# Altium project Flyback.PrjPcb
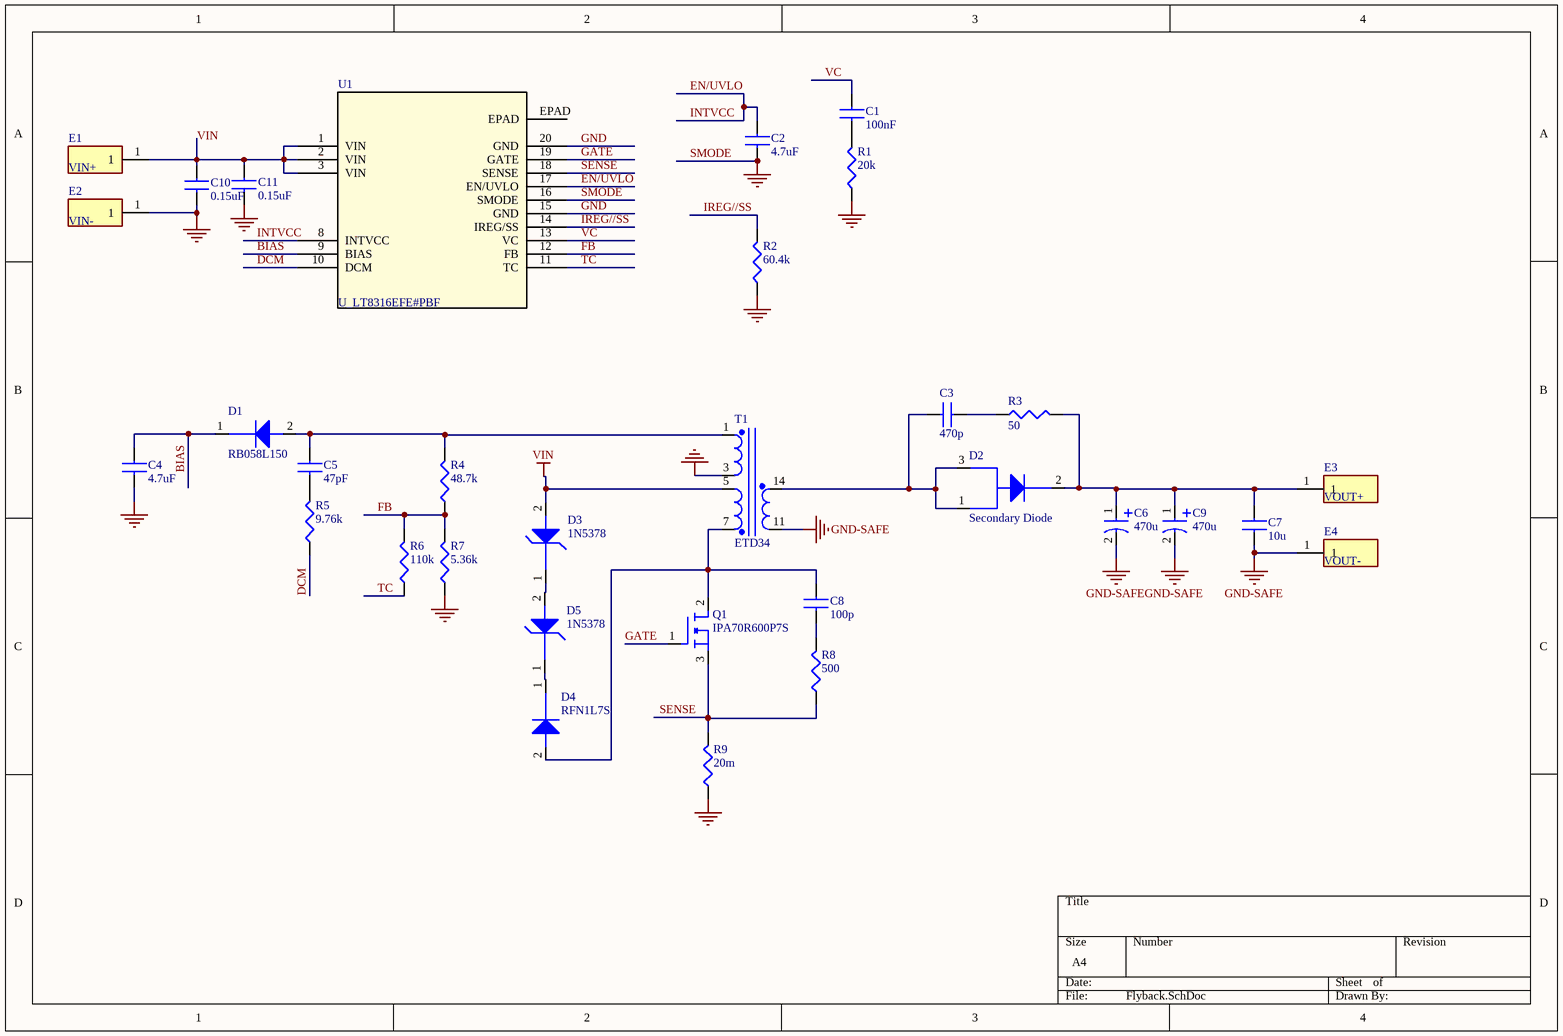
[diagram p0: Flyback.SchDoc]
1 sheet, 32 parts. Net scope: global (net labels, ports and power ports of the same name join across sheets).
Board file: Flyback.PcbDoc

## Sheet Flyback.SchDoc
size A4

### Parts
C1  100nF  [C0402]
C2  4.7uF  [C0805]
C3  470p  [C0402]
C4  4.7uF  [C0805]
C5  47pF  [C0603]
C6  470u  [C6.3x12]
C7  10u  [C0805]
C8  100p  [C1206]
C9  470u  [C6.3x12]
C10  0.15uF  [C1210]
C11  0.15uF  [C1210]
D1  RB058L150  [SOD128]
D2  Secondary Diode  [TO220AB]
D3  1N5378  [D017AA]
D4  RFN1L7S  [DO214_AC_SMA]
D5  1N5378  [D017AA]
E1  VIN+  [MILMAX_2501-2-00-80-00-00-07-0]
E2  VIN-  [MILMAX_2501-2-00-80-00-00-07-0]
E3  VOUT+  [MILMAX_2501-2-00-80-00-00-07-0]
E4  VOUT-  [MILMAX_2501-2-00-80-00-00-07-0]
Q1  IPA70R600P7S  [TO220_FullPAK]
R1  20k  [R0603]
R2  60.4k  [R0603]
R3  50  [R0603]
R4  48.7k  [R0603]
R5  9.76k  [R0603]
R6  110k  [R0603]
R7  5.36k  [R0603]
R8  500  [R2512]
R9  20m  [R1220]
T1  ETD34  [ETD34_CoilFormer]
U1  U_LT8316EFE#PBF  [LT8316EFE]

### Nets
GND: C2.1 C4.1 C10.1 C11.1 E2.1 R1.1 R2.1 R7.1 R9.1 T1.3 U1.15(GND) U1.16(SMODE) U1.20(GND)  [also labelled SMODE]
GND-SAFE: C6.2 C7.1 C9.2 E4.1 T1.11
VIN: C10.2 C11.2 D3.2 E1.1 T1.5 U1.1(VIN) U1.2(VIN) U1.3(VIN)
BIAS: C4.2 D1.1 U1.9(BIAS)
DCM: R5.1 U1.10(DCM)
EN/UVLO: C2.2 U1.8(INTVCC) U1.17(EN/UVLO)  [also labelled INTVCC]
FB: R4.1 R6.2 R7.2 U1.12(FB)
GATE: Q1.1 U1.19(GATE)
IREG//SS: R2.2 U1.14(IREG/SS)
SENSE: Q1.3 R8.1 R9.2 U1.18(SENSE)
TC: R6.1 U1.11(TC)
VC: C1.2 U1.13(VC)
NetC1_1: C1.1 R1.2
NetC3_1: C3.1 D2.1 D2.3 T1.14
NetC3_2: C3.2 R3.1
NetC5_1: C5.1 R5.2
NetC5_2: C5.2 D1.2 R4.2 T1.1
NetC6_1: C6.1 C7.2 C9.1 D2.2 E3.1 R3.2
NetC8_1: C8.1 R8.2
NetC8_2: C8.2 D4.2 Q1.2 T1.7
NetD3_1: D3.1 D5.2
NetD4_1: D4.1 D5.1

Not connected (* = marked no-connect by the designer): U1 EPAD

### Library data of the parts
C1 = C_Vc: CAP CER 0.1UF 25V X7R 0402 / GRM155R71E104KE14J; Manufacturer: Murata; Tolerance: 10%; Supplier 1: Digi-Key; Supplier Part Number 1: 490-14603-1-ND; Manufacturer Part Number: GRM155R71E104KE14J; RoHS: Yes; Category: Capacitors; Stock 1: 1830340; Pricing 1: 1=0,10000, 10=0,02800, 50=0,01520, 100=0,01240, 500=0,00886, 1000=0,00696, 2500=0,00632, 5000=0,00582 (USD); Mount: Surface Mount; Case/Package: 0402; Case Code (Imperial): 0402; Case Code (Metric): 1005; Weight: 0.000212oz; Min Operating Temperature: -55°C; Max Operating Temperature: 125°C; Packaging: Tape and Reel; Capacitance: 100nF; Voltage Rating: 25V; Dielectric: X7R; Termination: SMD/SMT; Resistor Type: Ceramic; Voltage Rating (DC): 25V; Package Quantity: 50000; Length: 0.039inch; Width: 0.5mm; Height: 0.5mm; Thickness: 0.022inch; RoHS Compliant: Yes; ComponentLink1URL: http://www.mouser.com/ds/2/281/c02e-2905.pdf?src-supplier=Mouser; ComponentLink1Description: http://www.mouser.com/ds/2/281/c02e-2905.pdf?src-supplier=Mouser; ComponentLink2URL: http://search.murata.co.jp/Ceramy/image/img/A01X/G101/ENG/GRM155R71E104KE14-01.pdf?src-supplier=Digi-Key; ComponentLink2Description: http://search.murata.co.jp/Ceramy/image/img/A01X/G101/ENG/GRM155R71E104KE14-01.pdf?src-supplier=Digi-Key
C2 = C_IntVcc: CAP CER 4.7UF 25V X5R 0805 / GRM219R61E475MA73D; Manufacturer: Murata; Tolerance: 20%; Supplier 1: Digi-Key; Supplier Part Number 1: 490-14644-1-ND; Manufacturer Part Number: GRM219R61E475MA73D; RoHS: Yes; Category: Ceramic Capacitors; Stock 1: 107733; Pricing 1: 1=0,28000, 10=0,19400, 50=0,11640, 100=0,09830, 500=0,06728, 1000=0,05951 (USD); Mount: Surface Mount; Case/Package: 0805; Min Operating Temperature: -55°C; Max Operating Temperature: 85°C; Packaging: Tape and Reel; Capacitance: 4.7uF; Voltage Rating: 25V; Voltage Rating (DC): 25V; Dielectric: X5R; Length: 0.079inch; Width: 0.049inch; Thickness: 0.037inch; RoHS Compliant: Yes; ComponentLink1URL: http://search.murata.co.jp/Ceramy/image/img/A01X/G101/ENG/GRM219R61E475MA73-01.pdf?src-supplier=Digi-Key; ComponentLink1Description: http://search.murata.co.jp/Ceramy/image/img/A01X/G101/ENG/GRM219R61E475MA73-01.pdf?src-supplier=Digi-Key; ComponentLink2URL: https://search.murata.co.jp/Ceramy/image/img/A01X/G101/ENG/GRM219R61E475MA73-01.pdf?src-supplier=Digi-Key; ComponentLink2Description: https://search.murata.co.jp/Ceramy/image/img/A01X/G101/ENG/GRM219R61E475MA73-01.pdf?src-supplier=Digi-Key
C3 = C_Snub_Sec: Cap Ceramic 470pF 100V X7R 10% SMD 0402 125C Paper T/R / GRM155R72A471KA01D; Manufacturer: Murata; Supplier 1: Digi-Key; Supplier Part Number 1: 490-6369-1-ND; Manufacturer Part Number: GRM155R72A471KA01D; RoHS: Yes; Category: Ceramic Capacitors; Stock 1: 9964; Pricing 1: 1=0,10000, 10=0,05300, 50=0,02900, 100=0,02370, 500=0,01690, 1000=0,01328, 2500=0,01208, 5000=0,01111 (USD); Mount: Surface Mount; Case/Package: 0402; Case Code (Metric): 1005; Case Code (Imperial): 0402; Min Operating Temperature: -55°C; Max Operating Temperature: 125°C; Capacitance: 470pF; Tolerance: 10%; Package Quantity: 10000; Voltage Rating: 100V; Packaging: Tape and Reel; Voltage Rating (DC): 100V; Dielectric: X7R; Termination: SMD/SMT; Voltage: 100V; Series: GRM; Construction: Flat; Length: 1mm; Width: 0.02inch; Height: 0.5mm; Thickness: 0.022inch; Depth: 0.5mm; Radiation Hardening: No; Lead Free: Lead Free; RoHS Compliant: Yes; ComponentLink1URL: https://datasheet.ciiva.com/6263/product-6263842.pdf?src-supplier=Digi-Key; ComponentLink1Description: https://datasheet.ciiva.com/6263/product-6263842.pdf?src-supplier=Digi-Key; ComponentLink2URL: https://datasheet.ciiva.com/6263/partnumbering-e-01-6263846.pdf?src-supplier=Digi-Key; ComponentLink2Description: https://datasheet.ciiva.com/6263/partnumbering-e-01-6263846.pdf?src-supplier=Digi-Key; ComponentLink3URL: https://datasheet.ciiva.com/11604/product-11604842.pdf?src-supplier=Avnet; ComponentLink3Description: https://datasheet.ciiva.com/11604/product-11604842.pdf?src-supplier=Avnet
C4 = C_Bias: CAP CER 4.7UF 35V 10% X5R 0805 / GRM219R6YA475KA73D; Manufacturer: Murata; Material: Ceramic; Supplier 1: Digi-Key; Supplier Part Number 1: 490-7208-1-ND; Manufacturer Part Number: GRM219R6YA475KA73D; RoHS: Yes; Category: Ceramic Capacitors; Stock 1: 73735; Pricing 1: 1=0,26000, 10=0,18100, 50=0,12060, 100=0,10250, 500=0,07234, 1000=0,06330 (USD); Mount: Surface Mount; Case/Package: 0805; Case Code (Metric): 2012; Case Code (Imperial): 0805; Weight: 0.000335oz; Dielectric Material: Ceramic; Min Operating Temperature: -55°C; Max Operating Temperature: 85°C; Voltage Rating: 35V; Tolerance: 10%; Package Quantity: 1; Packaging: Tape and Reel; Capacitance: 4.7uF; Dielectric: X5R; Voltage: 35V; Termination: SMD/SMT; Voltage Rating (DC): 35V; Series: GRM; Length: 2mm; Width: 1.25mm; Height: 0.85mm; Thickness: 0.037inch; Depth: 1.25mm; Lead Free: Lead Free; RoHS Compliant: Yes; ComponentLink1URL: https://datasheet.ciiva.com/14906/partnumbering-e-01-14906486.pdf?src-supplier=Digi-Key; ComponentLink1Description: https://datasheet.ciiva.com/14906/partnumbering-e-01-14906486.pdf?src-supplier=Digi-Key; ComponentLink2URL: https://datasheet.ciiva.com/18697/partnumbering-e-01-18697370.pdf?src-supplier=Digi-Key; ComponentLink2Description: https://datasheet.ciiva.com/18697/partnumbering-e-01-18697370.pdf?src-supplier=Digi-Key
C5 = C_DCM: MURATA - GRM1885C2A470JA01D - SMD Multilayer Ceramic Capacitor, 47 pF, 100 V, 0603 [1608 Metric], ± 5%, C0G / NP0, GRM Series; Voltage Rating: 100V; Temperature Coefficient: 30ppm/°C; Supplier 1: Digi-Key; Supplier Part Number 1: 490-1343-1-ND; Manufacturer: Murata; Manufacturer Part Number: GRM1885C2A470JA01D; RoHS: Yes; Category: Capacitors; Stock 1: 150902; Pricing 1: 1=0,11000, 10=0,07600, 50=0,04340, 100=0,03590, 500=0,02516, 1000=0,02083 (USD); Mount: Surface Mount; Case/Package: 0603; Case Code (Metric): 1608; Case Code (Imperial): 0603; Material: Ceramic; Min Operating Temperature: -55°C; Max Operating Temperature: 125°C; Package Quantity: 1; Capacitance: 47pF; Tolerance: 5%; Packaging: Tape and Reel; Voltage Rating (DC): 100V; Dielectric: C0G; Termination: SMD/SMT; Voltage: 100V; Series: GRM; Construction: Flat; Length: 1.6mm; Width: 0.031inch; Height: 0.8mm; Thickness: 0.035inch; Depth: 0.8mm; Radiation Hardening: No; REACH SVHC: No SVHC; Lead Free: Lead Free; RoHS Compliant: Yes; ComponentLink1URL: https://datasheet.ciiva.com/132/product-132289.pdf?src-supplier=Digi-Key; ComponentLink1Description: https://datasheet.ciiva.com/132/product-132289.pdf?src-supplier=Digi-Key; ComponentLink2URL: https://datasheet.ciiva.com/11786/0900766b80ef921d-11786149.pdf?src-supplier=RSComponents; ComponentLink2Description: https://datasheet.ciiva.com/11786/0900766b80ef921d-11786149.pdf?src-supplier=RSComponents; ComponentLink3URL: https://datasheet.ciiva.com/18101/getdatasheetpartid-37998-18101094.pdf?src-supplier=Verical; ComponentLink3Description: https://datasheet.ciiva.com/18101/getdatasheetpartid-37998-18101094.pdf?src-supplier=Verical; ComponentLink4URL: https://datasheet.ciiva.com/29202/451301-da-01-en-vs-kondensator-0603-29202381.pdf?src-supplier=Conrad; ComponentLink4Description: https://datasheet.ciiva.com/29202/451301-da-01-en-vs-kondensator-0603-29202381.pdf?src-supplier=Conrad; ComponentLink5URL: https://datasheet.ciiva.com/132/partnumbering-e-01-132290.pdf?src-supplier=Digi-Key; ComponentLink5Description: https://datasheet.ciiva.com/132/partnumbering-e-01-132290.pdf?src-supplier=Digi-Key; ComponentLink6URL: https://datasheet.ciiva.com/132/partnumbering-e-01-132291.pdf?src-supplier=Digi-Key; ComponentLink6Description: https://datasheet.ciiva.com/132/partnumbering-e-01-132291.pdf?src-supplier=Digi-Key; ComponentLink7URL: https://datasheet.ciiva.com/5424/product-5424681.pdf?src-supplier=Mouser; ComponentLink7Description: https://datasheet.ciiva.com/5424/product-5424681.pdf?src-supplier=Mouser; ComponentLink8URL: https://datasheet.ciiva.com/11463/product-11463932.pdf?src-supplier=Avnet; ComponentLink8Description: https://datasheet.ciiva.com/11463/product-11463932.pdf?src-supplier=Avnet; ComponentLink9URL: https://datasheet.ciiva.com/16497/product-16497070.pdf?src-supplier=Future+Electronics; ComponentLink9Description: https://datasheet.ciiva.com/16497/product-16497070.pdf?src-supplier=Future+Electronics
C6 C9 = C_OUT_470u: Solid Polymer Aluminum, Radial, Output Capacitor / A750EQ477M1CAAE015; Manufacturer: KEMET; Supplier 1: Digi-Key; Supplier Part Number 1: 399-A750EQ477M1CAAE015-ND; Manufacturer Part Number: A750EQ477M1CAAE015; Stock 1: 1592; Pricing 1: 1=0,53000, 10=0,37700, 50=0,28520, 100=0,24840, 500=0,18400, 1000=0,15640, 2500=0,14720, 5000=0,13800 (USD)
C7 = C_OUT_10u: MURATA - GRM21BR61E106MA73L - SMD Multilayer Ceramic Capacitor, 10 µF, 25 V, 0805 [2012 Metric], ± 20%, X5R, GRM Series; Capacitance: 10uF; Voltage Rating: 25V; Supplier 1: Digi-Key; Supplier Part Number 1: 490-10748-1-ND; Manufacturer: Murata; Manufacturer Part Number: GRM21BR61E106MA73L; RoHS: Yes; Category: Ceramic Capacitors; Stock 1: 350987; Pricing 1: 1=0,26000, 10=0,17900, 50=0,11960, 100=0,10170, 500=0,07176, 1000=0,06279 (USD); Mount: Surface Mount; Case/Package: 0805; Case Code (Metric): 2012; Case Code (Imperial): 0805; Weight: 0.000335oz; Min Operating Temperature: -55°C; Max Operating Temperature: 85°C; Tolerance: 20%; Packaging: Tape and Reel; Dielectric: X5R; Termination: SMD/SMT; Resistor Type: Ceramic; Voltage Rating (DC): 25V; Package Quantity: 3000; Length: 2mm; Width: 0.049inch; Height: 1.25mm; Thickness: 0.055inch; Depth: 1.25mm; REACH SVHC: No SVHC; Lead Free: Lead Free; RoHS Compliant: Yes; ComponentLink1URL: http://www.farnell.com/datasheets/2079185.pdf?src-supplier=Farnell; ComponentLink1Description: http://www.farnell.com/datasheets/2079185.pdf?src-supplier=Farnell; ComponentLink2URL: http://www.mouser.com/ds/2/281/c02e-2905.pdf?src-supplier=Mouser; ComponentLink2Description: http://www.mouser.com/ds/2/281/c02e-2905.pdf?src-supplier=Mouser; ComponentLink3URL: http://components.arrow.com/part/dataview/0323_03061623?src-supplier=Arrow+Europe; ComponentLink3Description: http://components.arrow.com/part/dataview/0323_03061623?src-supplier=Arrow+Europe; ComponentLink4URL: https://search.murata.co.jp/Ceramy/image/img/A01X/G101/ENG/GRM21BR61E106MA73-01.pdf?src-supplier=Digi-Key; ComponentLink4Description: https://search.murata.co.jp/Ceramy/image/img/A01X/G101/ENG/GRM21BR61E106MA73-01.pdf?src-supplier=Digi-Key; ComponentLink5URL: http://www.farnell.com/datasheets/2079185.pdf?src-supplier=Element14; ComponentLink5Description: http://www.farnell.com/datasheets/2079185.pdf?src-supplier=Element14
C8 = C_Snub_Pri: CAP CER 100PF 630V C0G/NP0 1206 / GRM31A5C2J101JW01D; Manufacturer: Murata; Tolerance: 10%; Dielectric: C0G; Voltage: 500V; Temperature Coefficient: 30ppm/°C; Supplier 1: Digi-Key; Supplier Part Number 1: 490-5273-1-ND; Manufacturer Part Number: GRM31A5C2J101JW01D; RoHS: Yes; Category: Ceramic Capacitors; Stock 1: 140494; Pricing 1: 1=0,48000, 10=0,33300, 50=0,23340, 100=0,20000, 500=0,14998, 1000=0,12665 (USD); Mount: Surface Mount; Case/Package: 1206; Case Code (Imperial): 1206; Case Code (Metric): 3216; Min Operating Temperature: -55°C; Max Operating Temperature: 125°C; Capacitance: 100pF; Voltage Rating: 630V; Packaging: Tape and Reel; Voltage Rating (DC): 630V; Package Quantity: 1; Termination: SMD/SMT; Series: GRM; Construction: Flat; Length: 3.2mm; Width: 1.6mm; Height: 1mm; Thickness: 0.039inch; Depth: 1.6mm; Radiation Hardening: No; REACH SVHC: No SVHC; Lead Free: Lead Free; RoHS Compliant: Yes; ComponentLink1URL: https://datasheet.ciiva.com/6173/608985-6173110.pdf?src-supplier=Farnell; ComponentLink1Description: https://datasheet.ciiva.com/6173/608985-6173110.pdf?src-supplier=Farnell; ComponentLink2URL: https://datasheet.ciiva.com/22703/608985-22703466.pdf?src-supplier=Element14; ComponentLink2Description: https://datasheet.ciiva.com/22703/608985-22703466.pdf?src-supplier=Element14; ComponentLink3URL: https://datasheet.ciiva.com/138/partnumbering-e-01-138811.pdf?src-supplier=Digi-Key; ComponentLink3Description: https://datasheet.ciiva.com/138/partnumbering-e-01-138811.pdf?src-supplier=Digi-Key; ComponentLink4URL: https://datasheet.ciiva.com/138/partnumbering-e-01-138812.pdf?src-supplier=Digi-Key; ComponentLink4Description: https://datasheet.ciiva.com/138/partnumbering-e-01-138812.pdf?src-supplier=Digi-Key; ComponentLink5URL: https://datasheet.ciiva.com/138/partnumbering-e-01-138813.pdf?src-supplier=Digi-Key; ComponentLink5Description: https://datasheet.ciiva.com/138/partnumbering-e-01-138813.pdf?src-supplier=Digi-Key; ComponentLink6URL: https://datasheet.ciiva.com/16214/product-16214765.pdf?src-supplier=Future+Electronics; ComponentLink6Description: https://datasheet.ciiva.com/16214/product-16214765.pdf?src-supplier=Future+Electronics
C10 C11 = C_Input: CAP CER 0.15UF 500V X7R 1210 / C1210C154KCRACTU; Manufacturer: KEMET; Dielectric Material: Ceramic; Capacitance: 150nF; Tolerance: 10%; Supplier 1: Digi-Key; Supplier Part Number 1: 399-13485-1-ND; Manufacturer Part Number: C1210C154KCRACTU; RoHS: Yes; Category: Ceramic Capacitors; Stock 1: 23364; Pricing 1: 1=0,49000, 10=0,34400, 50=0,26020, 100=0,22660, 500=0,16786, 1000=0,14268 (USD); Mount: Surface Mount; Case/Package: 1210; Case Code (Imperial): 1210; Case Code (Metric): 3225; Min Operating Temperature: -55°C; Max Operating Temperature: 125°C; Dielectric: X7R; Packaging: Tape and Reel; Voltage Rating (DC): 500V; Voltage Rating: 500V; Length: 0.126inch; Width: 0.098inch; Thickness: 0.091inch; RoHS Compliant: Yes; ComponentLink1URL: https://api.kemet.com/component-edge/download/datasheet/C1210C154KCRAC7800.pdf?src-supplier=Digi-Key; ComponentLink1Description: https://api.kemet.com/component-edge/download/datasheet/C1210C154KCRAC7800.pdf?src-supplier=Digi-Key; ComponentLink2URL: http://www.kemet.com/docfinder?Partnumber=C1210C154KCRAC7800&src-supplier=Digi-Key; ComponentLink2Description: http://www.kemet.com/docfinder?Partnumber=C1210C154KCRAC7800&src-supplier=Digi-Key; ComponentLink3URL: http://capacitoredge.kemet.com/capedge2/DataSheet/Datasheet-C1210C154KCRACTU.pdf?pn=C1210C154KCRACTU&src-supplier=Avnet; ComponentLink3Description: http://capacitoredge.kemet.com/capedge2/DataSheet/Datasheet-C1210C154KCRACTU.pdf?pn=C1210C154KCRACTU&src-supplier=Avnet
D1 = D_RB058LAM150TR: Schottky Barrier Diode for general rectification Diode for Bias Pin; Manufacturer: Rohm; Supplier 1: Digi-Key; Supplier Part Number 1: RB058LAM150CT-ND; Manufacturer Part Number: RB058LAM150TR; RoHS: Yes; Stock 1: 50; Pricing 1: 1=0,45000, 10=0,34000, 100=0,21190, 500=0,14500, 1000=0,11154 (USD); RoHS Compliant: Yes; ComponentLink1URL: http://www.farnell.com/datasheets/2646192.pdf?src-supplier=Farnell; ComponentLink1Description: http://www.farnell.com/datasheets/2646192.pdf?src-supplier=Farnell; ComponentLink2URL: http://www.farnell.com/datasheets/2646192.pdf?src-supplier=Element14; ComponentLink2Description: http://www.farnell.com/datasheets/2646192.pdf?src-supplier=Element14; ComponentLink3URL: http://www.farnell.com/datasheets/2646192.pdf?src-supplier=Newark; ComponentLink3Description: http://www.farnell.com/datasheets/2646192.pdf?src-supplier=Newark
D2 = D_STPS20SM120ST: Diode Schottky 120V 20A 3-Pin(3+Tab) TO-220AB Tube; Manufacturer: STMicroelectronics; Average Rectified Current: 1A; Max Reverse Voltage (DC): 170V; Supplier 1: Digi-Key; Supplier Part Number 1: 497-15563-5-ND; Manufacturer Part Number: STPS20SM120ST; RoHS: Yes; Category: Diodes; Stock 1: 911; Pricing 1: 1=0,96000, 10=0,85700, 100=0,66800, 500=0,55184, 1000=0,47950 (USD); Mount: Through Hole; Case/Package: TO-220-3; Packaging: Rail/Tube; RoHS Compliant: Yes; ComponentLink1URL: http://www.mouser.com/ds/2/389/stps20sm120s-956541.pdf?src-supplier=Mouser; ComponentLink1Description: http://www.mouser.com/ds/2/389/stps20sm120s-956541.pdf?src-supplier=Mouser; ComponentLink2URL: http://www.st.com/content/ccc/resource/technical/document/datasheet/e2/07/21/fe/c4/89/44/63/DM00050163.pdf/files/DM00050163.pdf/jcr:content/translations/en.DM00050163.pdf?src-supplier=Digi-Key; ComponentLink2Description: http://www.st.com/content/ccc/resource/technical/document/datasheet/e2/07/21/fe/c4/89/44/63/DM00050163.pdf/files/DM00050163.pdf/jcr:content/translations/en.DM00050163.pdf?src-supplier=Digi-Key; ComponentLink3URL: http://www.st.com/st-web-ui/static/active/en/resource/technical/document/datasheet/DM00050163.pdf?src-supplier=Avnet; ComponentLink3Description: http://www.st.com/st-web-ui/static/active/en/resource/technical/document/datasheet/DM00050163.pdf?src-supplier=Avnet
D3 D5 = D_1N5378BG: DIODE ZENER 100V 5W AXIAL / 1N5378BG; Manufacturer: ON Semiconductor; Tolerance: 5%; Forward Voltage: 1.2V; Max Reverse Leakage Current: 500nA; Impedance: 90R; Zener Current: 47.5mA; Test Current: 12mA; Element Configuration: Single; Supplier 1: Digi-Key; Supplier Part Number 1: 1N5378BGOS-ND; Manufacturer Part Number: 1N5378BG; RoHS: Yes; Category: Zener Diodes; Stock 1: 2406; Pricing 1: 1=0,47000, 10=0,40100, 100=0,29980, 500=0,23554, 1000=0,18200, 2000=0,17675 (USD); Case/Package: Axial; Number of Pins: 2; Weight: 0.01lb; Min Operating Temperature: -65°C; Max Operating Temperature: 200°C; Packaging: Bulk; Power Rating: 5W; Voltage Rating (DC): 100V; Breakdown Voltage: 100V; Max Power Dissipation: 5W; Package Quantity: 1000; Power Dissipation: 5W; Zener Voltage: 100V; Voltage Tolerance: 5%; Working Voltage: 100V; Max Reverse Current: 500nA; Diameter: 3.68mm; Length: 8.89mm; Width: 0.25inch; Height: 0.25inch; Radiation Hardening: No; REACH SVHC: No SVHC; Lead Free: Lead Free; Halogen Free: Halogen Free; ComponentLink1URL: https://datasheet.ciiva.com/30478/0900766b811a6372-30478593.pdf?src-supplier=RSComponents; ComponentLink1Description: https://datasheet.ciiva.com/30478/0900766b811a6372-30478593.pdf?src-supplier=RSComponents; ComponentLink2URL: https://datasheet.ciiva.com/15142/getdatasheetpartid-69059-15142345.pdf?src-supplier=Verical; ComponentLink2Description: https://datasheet.ciiva.com/15142/getdatasheetpartid-69059-15142345.pdf?src-supplier=Verical; ComponentLink3URL: https://datasheet.ciiva.com/1182/111735-1182244.pdf?src-supplier=Element14; ComponentLink3Description: https://datasheet.ciiva.com/1182/111735-1182244.pdf?src-supplier=Element14; ComponentLink4URL: https://datasheet.ciiva.com/14127/ib1n53xxb-14127221.pdf?src-supplier=Distrelec; ComponentLink4Description: https://datasheet.ciiva.com/14127/ib1n53xxb-14127221.pdf?src-supplier=Distrelec; ComponentLink5URL: https://datasheet.ciiva.com/8345/1n5333b-d-8345832.pdf?src-supplier=Avnet; ComponentLink5Description: https://datasheet.ciiva.com/8345/1n5333b-d-8345832.pdf?src-supplier=Avnet; ComponentLink6URL: https://datasheet.ciiva.com/14558/70099451-14558296.pdf?src-supplier=Allied+Electronics; ComponentLink6Description: https://datasheet.ciiva.com/14558/70099451-14558296.pdf?src-supplier=Allied+Electronics; ComponentLink7URL: https://datasheet.ciiva.com/4733/1n5333b-d-102336-4733738.pdf?src-supplier=Mouser; ComponentLink7Description: https://datasheet.ciiva.com/4733/1n5333b-d-102336-4733738.pdf?src-supplier=Mouser; ComponentLink8URL: https://datasheet.ciiva.com/895/1n5333b-d-895423.pdf?src-supplier=Digi-Key; ComponentLink8Description: https://datasheet.ciiva.com/895/1n5333b-d-895423.pdf?src-supplier=Digi-Key
D4 = D_RFN1L7SDDTE25: Clamp circuit fast diode; Manufacturer: Rohm; Supplier 1: Digi-Key; Supplier Part Number 1: 846-RFN1L7SDDTE25TR-ND; Manufacturer Part Number: RFN1L7SDDTE25; RoHS: Yes
E1-E4 = Connector: TERM TURRET SINGLE L=5.56MM TIN / 2501-2-00-80-00-00-07-0; Manufacturer: Mill-Max; Gender: Male; Outside Diameter: 3.18mm; Hole Diameter: 0.094inch; Board Thickness: 1.57mm; Mounting Hole Diameter: 2.39mm; Pin Diameter: 0.047inch; Supplier 1: Digi-Key; Supplier Part Number 1: ED90581-ND; Manufacturer Part Number: 2501-2-00-80-00-00-07-0; RoHS: Yes; Category: Terminals; Stock 1: 4209; Pricing 1: 1=0,23000, 10=0,21400, 25=0,18240, 50=0,15940, 100=0,14810, 250=0,13100, 500=0,12530, 1000=0,10252, 2500=0,09397 (USD); Mount: Through Hole; Material: Brass; Plating: Tin; Package Quantity: 500; Packaging: Bulk; Length: 0.328inch; Lead Free: Lead Free; RoHS Compliant: Yes; ComponentLink1URL: https://datasheet.ciiva.com/12487/2501-2-00-80-00-00-07-0-89719-12487471.pdf?src-supplier=Mouser; ComponentLink1Description: https://datasheet.ciiva.com/12487/2501-2-00-80-00-00-07-0-89719-12487471.pdf?src-supplier=Mouser
Q1 = Q_IPA70R600P7SXKSA1: Single N-Channel 700V 600 mOhm 10.5 nC CoolMOS Power Mosfet - TO-220-3FP; Manufacturer: Infineon; Continuous Drain Current (ID): 8.5A; Rds On Max: 600mR; Input Capacitance: 364pF; Max Power Dissipation: 25W; Supplier 1: Digi-Key; Supplier Part Number 1: IPA70R600P7SXKSA1-ND; Manufacturer Part Number: IPA70R600P7SXKSA1; RoHS: Yes; Category: MOSFETs; Stock 1: 111; Pricing 1: 1=1,03000, 10=0,91700, 25=0,87000, 100=0,71470, 500=0,59038, 1000=0,47285 (USD); Mount: Through Hole; Case/Package: TO-220-3; Min Operating Temperature: -40°C; Max Operating Temperature: 150°C; Max Dual Supply Voltage: 700V; Drain to Source Voltage (Vdss): 700V; Packaging: Rail/Tube; Lead Free: Lead Free; Halogen Free: Halogen Free; RoHS Compliant: Yes; ComponentLink1URL: https://www.infineon.com/dgdl/Infineon-IPA70R600P7S-DS-v02_00-EN.pdf?fileId=5546d462584d1d4a0158cf80e8880d96&src-supplier=Digi-Key; ComponentLink1Description: https://www.infineon.com/dgdl/Infineon-IPA70R600P7S-DS-v02_00-EN.pdf?fileId=5546d462584d1d4a0158cf80e8880d96&src-supplier=Digi-Key
R1 = R_CVc: D11/CRCW0603-C 100 20K 1% ET1 / CRCW060320K0FKEAC; Manufacturer: Vishay; Power Rating: 100mW; Resistance: 20kR; Temperature Coefficient: 100ppm/°C; Supplier 1: Digi-Key; Supplier Part Number 1: 541-3987-1-ND; Manufacturer Part Number: CRCW060320K0FKEAC; RoHS: Yes; Category: Resistors; Stock 1: 87681; Pricing 1: 1=0,10000, 10=0,03600, 100=0,01450, 1000=0,00652, 2500=0,00566 (USD); Mount: Surface Mount; Case/Package: Molded; Contact Plating: Tin; Min Operating Temperature: -55°C; Max Operating Temperature: 155°C; Tolerance: 1%; Resistor Type: Thick Film; Termination: Wraparound; Length: 1.55mm; Lead Free: Lead Free; RoHS Compliant: Yes; ComponentLink1URL: http://www.vishay.com/docs/28773/crcwce3.pdf?src-supplier=Digi-Key; ComponentLink1Description: http://www.vishay.com/docs/28773/crcwce3.pdf?src-supplier=Digi-Key
R2 = R_IREG//SS: VISHAY - CRCW060360K4FKEA - SMD Chip Resistor, 0603 [1608 Metric], 60.4 kohm, CRCW e3 Series, 75 V, Thick Film, 100 mW; Voltage Rating: 75V; Resistance: 60.4kR; Power Rating: 100mW; Tolerance: 1%; Temperature Coefficient: 100ppm/°C; Supplier 1: Digi-Key; Supplier Part Number 1: 541-60.4KHCT-ND; Manufacturer: Vishay; Manufacturer Part Number: CRCW060360K4FKEA; RoHS: Yes; Category: Resistors; Stock 1: 3660; Pricing 1: 1=0,10000, 10=0,03600, 100=0,01450, 1000=0,00652, 2500=0,00566 (USD); Case/Package: 0603; Weight: 7.1E-05oz; Case Code (Metric): 1608; Case Code (Imperial): 0603; Contact Plating: Tin; Size Code: 0603; Min Operating Temperature: -55°C; Max Operating Temperature: 155°C; Packaging: Tape and Reel; Package Quantity: 10; Resistor Type: Thick Film; Number of Terminations: 2; Termination: SMD/SMT; Max Power Dissipation: 100mW; Voltage Rating (DC): 75V; Features: Automotive AEC-Q200; Series: CRCW; Resistance Tolerance: 1%; Technology: THICK FILM; Construction: Rectangular; Length: 1.55mm; Width: 0.033inch; Height: 0.45mm; Depth: 0.85mm; Radiation Hardening: No; REACH SVHC: Unknown; Military Standard: Not; Lead Free: Lead Free; RoHS Compliant: Yes; ComponentLink1URL: https://datasheet.ciiva.com/11809/0900766b80d98afc-11809685.pdf?src-supplier=RSComponents; ComponentLink1Description: https://datasheet.ciiva.com/11809/0900766b80d98afc-11809685.pdf?src-supplier=RSComponents; ComponentLink2URL: https://datasheet.ciiva.com/7816/1697337-7816053.pdf?src-supplier=Element14; ComponentLink2Description: https://datasheet.ciiva.com/7816/1697337-7816053.pdf?src-supplier=Element14; ComponentLink3URL: https://datasheet.ciiva.com/2494/dcrcwe3-2494471.pdf?src-supplier=Digi-Key; ComponentLink3Description: https://datasheet.ciiva.com/2494/dcrcwe3-2494471.pdf?src-supplier=Digi-Key; ComponentLink4URL: https://datasheet.ciiva.com/16760/70201119-16760503.pdf?src-supplier=Allied+Electronics; ComponentLink4Description: https://datasheet.ciiva.com/16760/70201119-16760503.pdf?src-supplier=Allied+Electronics; ComponentLink5URL: https://datasheet.ciiva.com/2494/dcrcwe3-2494472.pdf?src-supplier=Digi-Key; ComponentLink5Description: https://datasheet.ciiva.com/2494/dcrcwe3-2494472.pdf?src-supplier=Digi-Key; ComponentLink6URL: https://datasheet.ciiva.com/16391/dcrcwe3-16391304.pdf?src-supplier=Future+Electronics; ComponentLink6Description: https://datasheet.ciiva.com/16391/dcrcwe3-16391304.pdf?src-supplier=Future+Electronics; ComponentLink7URL: https://datasheet.ciiva.com/16893/dcrcwe3-16893592.pdf?src-supplier=Avnet+Europe; ComponentLink7Description: https://datasheet.ciiva.com/16893/dcrcwe3-16893592.pdf?src-supplier=Avnet+Europe; ComponentLink8URL: https://datasheet.ciiva.com/2494/dcrcwe3-2494473.pdf?src-supplier=Digi-Key; ComponentLink8Description: https://datasheet.ciiva.com/2494/dcrcwe3-2494473.pdf?src-supplier=Digi-Key; ComponentLink9URL: https://datasheet.ciiva.com/5545/dcrcwe3-109170-5545721.pdf?src-supplier=Mouser; ComponentLink9Description: https://datasheet.ciiva.com/5545/dcrcwe3-109170-5545721.pdf?src-supplier=Mouser; ComponentLink10URL: https://datasheet.ciiva.com/3257/dcrcwe3-3257786.pdf?src-supplier=Avnet; ComponentLink10Description: https://datasheet.ciiva.com/3257/dcrcwe3-3257786.pdf?src-supplier=Avnet; ComponentLink11URL: https://datasheet.ciiva.com/22676/1847332-22676330.pdf?src-supplier=Element14; ComponentLink11Description: https://datasheet.ciiva.com/22676/1847332-22676330.pdf?src-supplier=Element14; ComponentLink12URL: https://datasheet.ciiva.com/3257/dcrcwe3-3257787.pdf?src-supplier=Avnet; ComponentLink12Description: https://datasheet.ciiva.com/3257/dcrcwe3-3257787.pdf?src-supplier=Avnet
R3 = R_Snubber_Sec: Vishay CRCW Series Thick Film Power Resistor 0603 Case 49.9 1% 0.25W 100ppm/K / CRCW060349R9FKEAHP; Manufacturer: Vishay Dale; Resistance: 49.9R; Power Rating: 250mW; Voltage Rating: 75V; Temperature Coefficient: 100ppm/°C; Supplier 1: Digi-Key; Supplier Part Number 1: 541-49.9SCT-ND; Manufacturer Part Number: CRCW060349R9FKEAHP; RoHS: Yes; Category: Chip SMD Resistors; Stock 1: 174736; Pricing 1: 1=0,17000, 10=0,14800, 100=0,05790, 1000=0,02422, 2500=0,02220 (USD); Mount: Surface Mount; Case/Package: 0603; Weight: 7.1E-05oz; Case Code (Metric): 1608; Case Code (Imperial): 0603; Contact Plating: Tin; Min Operating Temperature: -55°C; Max Operating Temperature: 155°C; Tolerance: 1%; Packaging: Tape and Reel; Package Quantity: 10; Resistor Type: Thick Film; Number of Terminations: 2; Termination: SMD/SMT; Max Power Dissipation: 250mW; Features: Automotive AEC-Q200; Series: CRCW-HP; Construction: Rectangular; Technology: THICK FILM; Length: 1.6mm; Width: 0.033inch; Height: 0.45mm; Depth: 0.85mm; Radiation Hardening: No; Military Standard: Not; Lead Free: Lead Free; RoHS Compliant: Yes; ComponentLink1URL: https://datasheet.ciiva.com/9003/crcwhpe3-9003461.pdf?src-supplier=Avnet; ComponentLink1Description: https://datasheet.ciiva.com/9003/crcwhpe3-9003461.pdf?src-supplier=Avnet; ComponentLink2URL: https://datasheet.ciiva.com/2578/crcwhpe3-2578506.pdf?src-supplier=Digi-Key; ComponentLink2Description: https://datasheet.ciiva.com/2578/crcwhpe3-2578506.pdf?src-supplier=Digi-Key; ComponentLink3URL: https://datasheet.ciiva.com/2578/crcwhpe3-2578507.pdf?src-supplier=Digi-Key; ComponentLink3Description: https://datasheet.ciiva.com/2578/crcwhpe3-2578507.pdf?src-supplier=Digi-Key; ComponentLink4URL: https://datasheet.ciiva.com/2578/crcwhpe3-2578508.pdf?src-supplier=Digi-Key; ComponentLink4Description: https://datasheet.ciiva.com/2578/crcwhpe3-2578508.pdf?src-supplier=Digi-Key; ComponentLink5URL: https://datasheet.ciiva.com/48525/crcwhpe3-48525900.pdf?src-supplier=Avnet; ComponentLink5Description: https://datasheet.ciiva.com/48525/crcwhpe3-48525900.pdf?src-supplier=Avnet; ComponentLink6URL: https://datasheet.ciiva.com/5547/crcwhpe3-46056-5547183.pdf?src-supplier=Mouser; ComponentLink6Description: https://datasheet.ciiva.com/5547/crcwhpe3-46056-5547183.pdf?src-supplier=Mouser
R4 = R_FB1: Res Thick Film 0603 48.7K Ohm 1% 0.1W(1/10W) ±100ppm/C Pad SMD Automotive T/R / CRCW060348K7FKEA; Manufacturer: Vishay; Resistance: 48.7kR; Power Rating: 100mW; Voltage Rating: 75V; Temperature Coefficient: 100ppm/°C; Supplier 1: Digi-Key; Supplier Part Number 1: 541-48.7KHCT-ND; Manufacturer Part Number: CRCW060348K7FKEA; RoHS: Yes; Category: Resistors; Stock 1: 2623; Pricing 1: 1=0,10000, 10=0,03600, 100=0,01450, 1000=0,00652, 2500=0,00566 (USD); Case/Package: 0603; Number of Pins: 2; Weight: 7.1E-05oz; Case Code (Metric): 1608; Case Code (Imperial): 0603; Contact Plating: Tin; Size Code: 0603; Min Operating Temperature: -55°C; Max Operating Temperature: 155°C; Package Quantity: 10; Tolerance: 1%; Packaging: Tape and Reel; Resistor Type: Thick Film; Number of Terminations: 2; Termination: SMD/SMT; Max Power Dissipation: 100mW; Features: Automotive AEC-Q200; Series: CRCW; Resistance Tolerance: 1%; Technology: THICK FILM; Construction: Rectangular; Length: 1.55mm; Width: 0.033inch; Height: 0.45mm; Depth: 0.85mm; Radiation Hardening: No; REACH SVHC: Unknown; Military Standard: Not; RoHS Compliant: Yes; ComponentLink1URL: https://datasheet.ciiva.com/3882/41397335s9853079n6892-3882805.pdf?src-supplier=Arrow+Electronics; ComponentLink1Description: https://datasheet.ciiva.com/3882/41397335s9853079n6892-3882805.pdf?src-supplier=Arrow+Electronics; ComponentLink2URL: https://datasheet.ciiva.com/11809/0900766b80d98afc-11809590.pdf?src-supplier=RSComponents; ComponentLink2Description: https://datasheet.ciiva.com/11809/0900766b80d98afc-11809590.pdf?src-supplier=RSComponents; ComponentLink3URL: https://datasheet.ciiva.com/2466/dcrcwe3-2466288.pdf?src-supplier=Digi-Key; ComponentLink3Description: https://datasheet.ciiva.com/2466/dcrcwe3-2466288.pdf?src-supplier=Digi-Key; ComponentLink4URL: https://datasheet.ciiva.com/2466/dcrcwe3-2466289.pdf?src-supplier=Digi-Key; ComponentLink4Description: https://datasheet.ciiva.com/2466/dcrcwe3-2466289.pdf?src-supplier=Digi-Key; ComponentLink5URL: https://datasheet.ciiva.com/16781/70201119-16781510.pdf?src-supplier=Allied+Electronics; ComponentLink5Description: https://datasheet.ciiva.com/16781/70201119-16781510.pdf?src-supplier=Allied+Electronics; ComponentLink6URL: https://datasheet.ciiva.com/7816/1697337-7816039.pdf?src-supplier=Element14; ComponentLink6Description: https://datasheet.ciiva.com/7816/1697337-7816039.pdf?src-supplier=Element14; ComponentLink7URL: https://datasheet.ciiva.com/16449/dcrcwe3-16449495.pdf?src-supplier=Future+Electronics; ComponentLink7Description: https://datasheet.ciiva.com/16449/dcrcwe3-16449495.pdf?src-supplier=Future+Electronics; ComponentLink8URL: https://datasheet.ciiva.com/7816/1697337-7816040.pdf?src-supplier=Element14; ComponentLink8Description: https://datasheet.ciiva.com/7816/1697337-7816040.pdf?src-supplier=Element14; ComponentLink9URL: https://datasheet.ciiva.com/16884/dcrcwe3-16884570.pdf?src-supplier=Avnet+Europe; ComponentLink9Description: https://datasheet.ciiva.com/16884/dcrcwe3-16884570.pdf?src-supplier=Avnet+Europe; ComponentLink10URL: https://datasheet.ciiva.com/5551/dcrcwe3-109170-5551868.pdf?src-supplier=Mouser; ComponentLink10Description: https://datasheet.ciiva.com/5551/dcrcwe3-109170-5551868.pdf?src-supplier=Mouser; ComponentLink11URL: https://datasheet.ciiva.com/3257/dcrcwe3-3257645.pdf?src-supplier=Avnet; ComponentLink11Description: https://datasheet.ciiva.com/3257/dcrcwe3-3257645.pdf?src-supplier=Avnet; ComponentLink12URL: https://datasheet.ciiva.com/22705/1697337-22705853.pdf?src-supplier=Element14; ComponentLink12Description: https://datasheet.ciiva.com/22705/1697337-22705853.pdf?src-supplier=Element14; ComponentLink13URL: https://datasheet.ciiva.com/2466/dcrcwe3-2466287.pdf?src-supplier=Digi-Key; ComponentLink13Description: https://datasheet.ciiva.com/2466/dcrcwe3-2466287.pdf?src-supplier=Digi-Key
R5 = R_DCM: Vishay CRCW Series Thick Film Surface Mount Resistor 0603 Case 9.76k 1% 0.1W 100ppm/K / CRCW06039K76FKEA; Resistance: 9.76kR; Power Rating: 100mW; Voltage Rating: 75V; Temperature Coefficient: 100ppm/°C; Supplier 1: Digi-Key; Supplier Part Number 1: 541-9.76KHCT-ND; Manufacturer: Vishay; Manufacturer Part Number: CRCW06039K76FKEA; RoHS: Yes; Category: Chip SMD Resistors; Stock 1: 4468; Pricing 1: 1=0,10000, 10=0,03600, 100=0,01450, 1000=0,00652, 2500=0,00566 (USD); Case/Package: 0603; Weight: 7.1E-05oz; Case Code (Imperial): 0603; Case Code (Metric): 1608; Contact Plating: Tin; Size Code: 0603; Min Operating Temperature: -55°C; Max Operating Temperature: 155°C; Tolerance: 1%; Packaging: Tape and Reel; Package Quantity: 10; Resistor Type: Thick Film; Number of Terminations: 2; Max Power Dissipation: 100mW; Voltage Rating (DC): 75V; Features: Automotive AEC-Q200; Series: CRCW; Resistance Tolerance: 1%; Construction: Rectangular; Termination: SMD/SMT; Technology: THICK FILM; Length: 1.55mm; Width: 0.85mm; Height: 0.45mm; Depth: 0.85mm; Radiation Hardening: No; REACH SVHC: Unknown; Military Standard: Not; Lead Free: Lead Free; RoHS Compliant: Yes; ComponentLink1URL: https://datasheet.ciiva.com/22872/70201119-22872343.pdf?src-supplier=Allied+Electronics; ComponentLink1Description: https://datasheet.ciiva.com/22872/70201119-22872343.pdf?src-supplier=Allied+Electronics; ComponentLink2URL: https://datasheet.ciiva.com/7792/125364-7792443.pdf?src-supplier=Element14; ComponentLink2Description: https://datasheet.ciiva.com/7792/125364-7792443.pdf?src-supplier=Element14; ComponentLink3URL: https://datasheet.ciiva.com/2466/dcrcwe3-2466253.pdf?src-supplier=Digi-Key; ComponentLink3Description: https://datasheet.ciiva.com/2466/dcrcwe3-2466253.pdf?src-supplier=Digi-Key; ComponentLink4URL: https://datasheet.ciiva.com/7673/1697337-7673325.pdf?src-supplier=Element14; ComponentLink4Description: https://datasheet.ciiva.com/7673/1697337-7673325.pdf?src-supplier=Element14; ComponentLink5URL: https://datasheet.ciiva.com/7673/1697337-7673326.pdf?src-supplier=Element14; ComponentLink5Description: https://datasheet.ciiva.com/7673/1697337-7673326.pdf?src-supplier=Element14; ComponentLink6URL: https://datasheet.ciiva.com/22702/1697337-22702901.pdf?src-supplier=Element14; ComponentLink6Description: https://datasheet.ciiva.com/22702/1697337-22702901.pdf?src-supplier=Element14; ComponentLink7URL: https://datasheet.ciiva.com/5541/dcrcwe3-109170-5541193.pdf?src-supplier=Mouser; ComponentLink7Description: https://datasheet.ciiva.com/5541/dcrcwe3-109170-5541193.pdf?src-supplier=Mouser; ComponentLink8URL: https://datasheet.ciiva.com/2466/dcrcwe3-2466251.pdf?src-supplier=Digi-Key; ComponentLink8Description: https://datasheet.ciiva.com/2466/dcrcwe3-2466251.pdf?src-supplier=Digi-Key; ComponentLink9URL: https://datasheet.ciiva.com/2466/dcrcwe3-2466252.pdf?src-supplier=Digi-Key; ComponentLink9Description: https://datasheet.ciiva.com/2466/dcrcwe3-2466252.pdf?src-supplier=Digi-Key
R6 = R_Tc: RES SMD 110K OHM 5% 1/10W 0603 / CRCW0603110KJNEA; Manufacturer: Vishay Dale; Resistance: 110kR; Power Rating: 100mW; Voltage Rating: 75V; Temperature Coefficient: 200ppm/°C; Supplier 1: Digi-Key; Supplier Part Number 1: 541-110KGCT-ND; Manufacturer Part Number: CRCW0603110KJNEA; RoHS: Yes; Category: Resistors; Stock 1: 16475; Pricing 1: 1=0,10000, 10=0,03200, 100=0,01310, 1000=0,00588, 2500=0,00510 (USD); Case/Package: 0603; Weight: 7.1E-05oz; Case Code (Imperial): 0603; Case Code (Metric): 1608; Contact Plating: Tin; Min Operating Temperature: -55°C; Max Operating Temperature: 155°C; Tolerance: 5%; Packaging: Tape and Reel; Package Quantity: 1; Termination: SMD/SMT; Resistor Type: Thick Film; Number of Terminations: 2; Max Power Dissipation: 100mW; Voltage Rating (DC): 75V; Features: Automotive AEC-Q200; Series: CRCW; Construction: Rectangular; Length: 1.55mm; Width: 0.85mm; Height: 0.02inch; Depth: 0.85mm; Radiation Hardening: No; Military Standard: Not; Lead Free: Lead Free; RoHS Compliant: Yes; ComponentLink1URL: https://datasheet.ciiva.com/3256/dcrcwe3-3256965.pdf?src-supplier=Avnet; ComponentLink1Description: https://datasheet.ciiva.com/3256/dcrcwe3-3256965.pdf?src-supplier=Avnet; ComponentLink2URL: https://datasheet.ciiva.com/5549/dcrcwe3-109170-5549509.pdf?src-supplier=Mouser; ComponentLink2Description: https://datasheet.ciiva.com/5549/dcrcwe3-109170-5549509.pdf?src-supplier=Mouser; ComponentLink3URL: https://datasheet.ciiva.com/2493/dcrcwe3-2493661.pdf?src-supplier=Digi-Key; ComponentLink3Description: https://datasheet.ciiva.com/2493/dcrcwe3-2493661.pdf?src-supplier=Digi-Key; ComponentLink4URL: https://datasheet.ciiva.com/2493/dcrcwe3-2493662.pdf?src-supplier=Digi-Key; ComponentLink4Description: https://datasheet.ciiva.com/2493/dcrcwe3-2493662.pdf?src-supplier=Digi-Key; ComponentLink5URL: https://datasheet.ciiva.com/2493/dcrcwe3-2493663.pdf?src-supplier=Digi-Key; ComponentLink5Description: https://datasheet.ciiva.com/2493/dcrcwe3-2493663.pdf?src-supplier=Digi-Key
R7 = R_FB2: VISHAY         CRCW06035K36FKEA.             SMD Chip Resistor, Thick Film, 5.36 kohm, 75 V, 0603 [1608 Metric], 100 mW,  1%, CRCW Series; Power Rating: 100mW; Voltage Rating: 75V; Resistance: 5.36kR; Temperature Coefficient: 100ppm/°C; Supplier 1: Digi-Key; Supplier Part Number 1: 541-5.36KHCT-ND; Manufacturer: Vishay; Manufacturer Part Number: CRCW06035K36FKEA; RoHS: Yes; Category: Resistors; Stock 1: 42; Pricing 1: 1=0,10000, 10=0,03600, 100=0,01450, 1000=0,00652, 2500=0,00566 (USD); Case/Package: 0603; Number of Pins: 2; Weight: 7.1E-05oz; Case Code (Imperial): 0603; Case Code (Metric): 1608; Contact Plating: Tin; Size Code: 0603; Min Operating Temperature: -55°C; Max Operating Temperature: 155°C; Tolerance: 1%; Packaging: Tape and Reel; Package Quantity: 5000; Resistor Type: Thick Film; Termination: SMD/SMT; Voltage Rating (DC): 75V; Features: Automotive AEC-Q200; Series: CRCW; Max Power Dissipation: 100mW; Number of Terminations: 2; Construction: Rectangular; Technology: THICK FILM; Resistance Tolerance: 1%; Length: 1.55mm; Width: 0.85mm; Height: 0.45mm; Depth: 0.85mm; Radiation Hardening: No; REACH SVHC: No SVHC; Military Standard: Not; Lead Free: Lead Free; RoHS Compliant: Yes; ComponentLink1URL: https://datasheet.ciiva.com/3257/dcrcwe3-3257765.pdf?src-supplier=Avnet; ComponentLink1Description: https://datasheet.ciiva.com/3257/dcrcwe3-3257765.pdf?src-supplier=Avnet; ComponentLink2URL: https://datasheet.ciiva.com/7679/1697337-7679125.pdf?src-supplier=Element14; ComponentLink2Description: https://datasheet.ciiva.com/7679/1697337-7679125.pdf?src-supplier=Element14; ComponentLink3URL: https://datasheet.ciiva.com/7679/1697337-7679126.pdf?src-supplier=Element14; ComponentLink3Description: https://datasheet.ciiva.com/7679/1697337-7679126.pdf?src-supplier=Element14; ComponentLink4URL: https://datasheet.ciiva.com/16789/70201119-16789112.pdf?src-supplier=Allied+Electronics; ComponentLink4Description: https://datasheet.ciiva.com/16789/70201119-16789112.pdf?src-supplier=Allied+Electronics; ComponentLink5URL: https://datasheet.ciiva.com/7792/125364-7792346.pdf?src-supplier=Element14; ComponentLink5Description: https://datasheet.ciiva.com/7792/125364-7792346.pdf?src-supplier=Element14; ComponentLink6URL: https://datasheet.ciiva.com/22707/1697337-22707754.pdf?src-supplier=Element14; ComponentLink6Description: https://datasheet.ciiva.com/22707/1697337-22707754.pdf?src-supplier=Element14; ComponentLink7URL: https://datasheet.ciiva.com/5541/dcrcwe3-109170-5541375.pdf?src-supplier=Mouser; ComponentLink7Description: https://datasheet.ciiva.com/5541/dcrcwe3-109170-5541375.pdf?src-supplier=Mouser
R8 = R_Snubber_Pri: Res Thick Film 2512 499 Ohm 1% 2W ±100ppm/°C Molded SMD SMD Paper T/R / CRM2512-FX-4990ELF; Manufacturer: Bourns; Resistance: 499R; Supplier 1: Digi-Key; Supplier Part Number 1: 118-CRM2512-FX-4990ELFCT-ND; Manufacturer Part Number: CRM2512-FX-4990ELF; RoHS: Yes; Category: Chip SMD Resistors; Stock 1: 10792; Pricing 1: 1=0,63000, 10=0,44800, 100=0,23320, 1000=0,12558 (USD); Case/Package: 2512; Min Operating Temperature: -55°C; Max Operating Temperature: 155°C; Resistor Type: Thick Film; Max Power Dissipation: 2W; Temperature Coefficient: 100ppm/°C; Number of Terminations: 2; Tolerance: 1%; Power Rating: 2W; Package Quantity: 4000; Packaging: Tape and Reel; Length: 0.248inch; Width: 0.122inch; Height: 0.031inch; ComponentLink1URL: https://datasheet.ciiva.com/9119/crm-9119624.pdf?src-supplier=Avnet; ComponentLink1Description: https://datasheet.ciiva.com/9119/crm-9119624.pdf?src-supplier=Avnet; ComponentLink2URL: https://datasheet.ciiva.com/29521/crm-29521785.pdf?src-supplier=Digi-Key; ComponentLink2Description: https://datasheet.ciiva.com/29521/crm-29521785.pdf?src-supplier=Digi-Key; ComponentLink3URL: https://datasheet.ciiva.com/16929/crm-16929438.pdf?src-supplier=Avnet+Europe; ComponentLink3Description: https://datasheet.ciiva.com/16929/crm-16929438.pdf?src-supplier=Avnet+Europe
R9 = R_Sense: TR / Current Sensors, 0805 0.25W, 5% / RL1220T-R020-J; Manufacturer: Susumu; Power Rating: 250mW; Resistance: 20mR; Temperature Coefficient: 350ppm/°C; Voltage Rating (DC): 100V; Supplier 1: Digi-Key; Supplier Part Number 1: RL12T.020JCT-ND; Manufacturer Part Number: RL1220T-R020-J; RoHS: Yes; Category: Resistors; Stock 1: 301682; Pricing 1: 1=0,35000, 10=0,30000, 25=0,21840, 50=0,15840, 100=0,11740, 250=0,09008, 500=0,07098, 1000=0,04914 (USD); Case/Package: 0805; Case Code (Metric): 2012; Case Code (Imperial): 0805; Weight: 0.000194oz; Min Operating Temperature: -55°C; Max Operating Temperature: 125°C; Tolerance: 5%; Package Quantity: 1; Packaging: Tape and Reel; Series: RL; Resistor Type: Thin Film; Number of Terminations: 2; Termination: SMD/SMT; Max Power Dissipation: 250mW; Technology: THIN FILM; Length: 0.079inch; Width: 0.049inch; Height: 0.028inch; Lead Free: Lead Free; RoHS Compliant: Yes; ComponentLink1URL: https://datasheet.ciiva.com/2488/rl-data-sheet-2488002.pdf?src-supplier=Digi-Key; ComponentLink1Description: https://datasheet.ciiva.com/2488/rl-data-sheet-2488002.pdf?src-supplier=Digi-Key; ComponentLink2URL: https://datasheet.ciiva.com/2488/rl-data-sheet-2488003.pdf?src-supplier=Digi-Key; ComponentLink2Description: https://datasheet.ciiva.com/2488/rl-data-sheet-2488003.pdf?src-supplier=Digi-Key; ComponentLink3URL: https://datasheet.ciiva.com/2488/rl-data-sheet-2488004.pdf?src-supplier=Digi-Key; ComponentLink3Description: https://datasheet.ciiva.com/2488/rl-data-sheet-2488004.pdf?src-supplier=Digi-Key; ComponentLink4URL: https://datasheet.ciiva.com/12915/e-15-16-12915302.pdf?src-supplier=Mouser; ComponentLink4Description: https://datasheet.ciiva.com/12915/e-15-16-12915302.pdf?src-supplier=Mouser
T1 = Transformer_CoilFormer: Epcos B66362W1014T001 ETD 34 Coil Former, 14 Pins / B66362W1014T001; Manufacturer: TDK EPCOS; Material: Polyterephthalate; Inside Diameter: 20.9mm; Outside Diameter: 25.4mm; Supplier 1: Digi-Key; Supplier Part Number 1: 495-5465-ND; Manufacturer Part Number: B66362W1014T001; RoHS: Yes; Category: Coil Former; Pricing 1: 1=1,99000, 10=1,71200, 25=1,30080, 50=1,23240, 100=1,09550, 250=1,02704, 500=0,95858, 1000=0,91065 (USD); Number of Pins: 14; Weight: 1.410958oz; Max Operating Temperature: 180°C; Package Quantity: 100; Termination: Pin; Packaging: Bulk; ComponentLink1URL: https://datasheet.ciiva.com/48906/70419804-48906870.pdf?src-supplier=Allied+Electronics; ComponentLink1Description: https://datasheet.ciiva.com/48906/70419804-48906870.pdf?src-supplier=Allied+Electronics
U1 = U_LT8316EFE#PBF: DC/DC Cntrlr Single-OUT 142kHz Automotive 16-Pin TSSOP EP Tube; Manufacturer: Analog Devices / Linear Technology; Supplier 1: Digi-Key; Supplier Part Number 1: LT8316EFE#PBF-ND; Manufacturer Part Number: LT8316EFE#PBF; RoHS: Yes; Pricing 1: 1=5,81000, 10=5,22200, 25=4,93680, 100=4,27870, 250=4,05928, 500=3,64238, 1000=3,10500 (USD)